# Altium schematic sheet POWER BLOCK DIAGRAM.SchDoc
size A
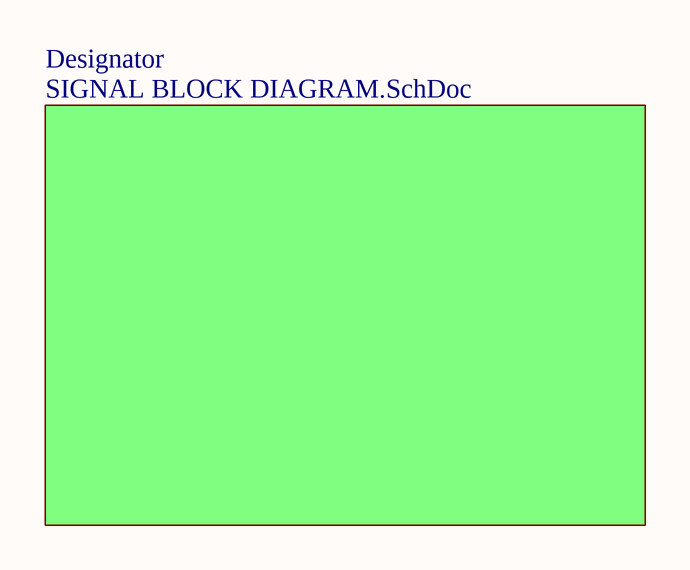
[diagram p0: POWER BLOCK DIAGRAM.SchDoc]

## Sub-sheets
Designator = SIGNAL BLOCK DIAGRAM.SchDoc: no entries